# EasyEDA schematic project2_sound_system_incompletev1.1.json
TITLE: Sistema de Som para cliente Y; REV: 1.0; Date: 2023-12-21; Sheet: 1/1; Drawn By: Equipa X; Company: Equipa X
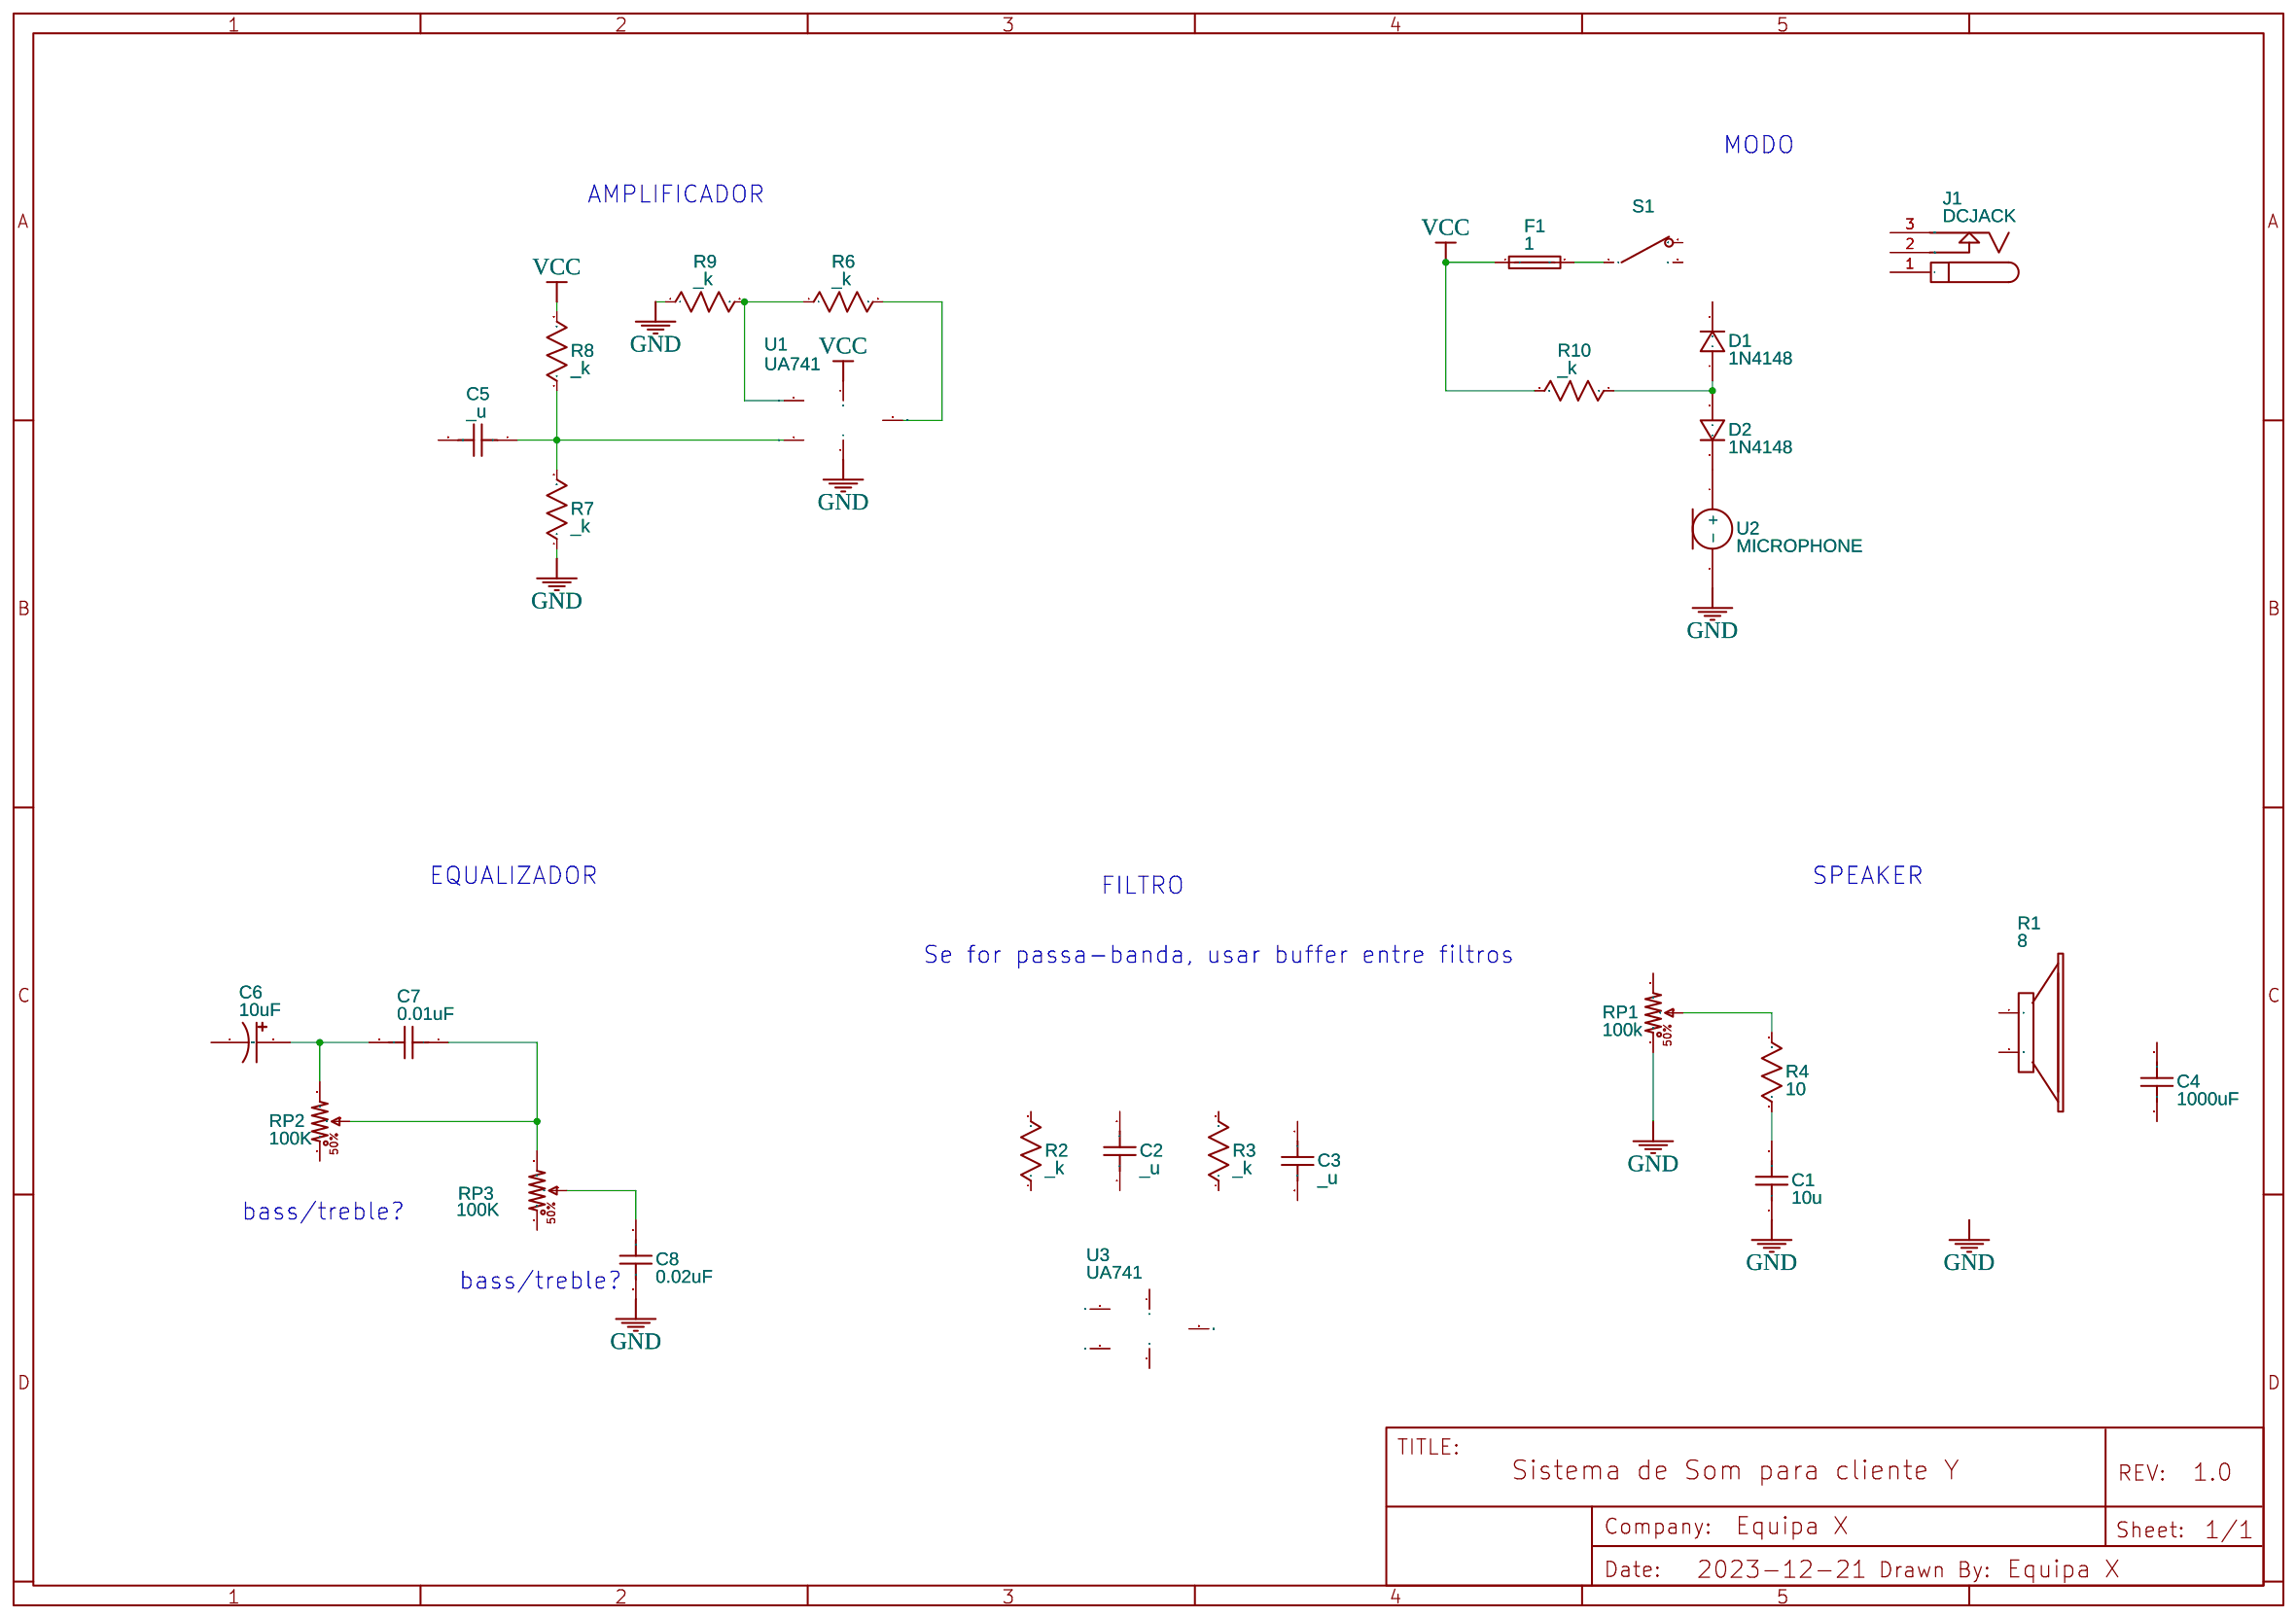
[diagram p0: schematic sheet]

## Parts
C1  10u  [RAD-0.1]
C2  _u  [RAD-0.1]
C3  _u  [RAD-0.1]
C4  1000uF  [RAD-0.1]
C5  _u  [RAD-0.1]
C6  10uF  [CAP-D3.0XF1.5]
C7  0.01uF  [RAD-0.1]
C8  0.02uF  [RAD-0.1]
D1  1N4148  [DO-35]
D2  1N4148  [DO-35]
F1  1
J1  DCJACK  [DC JACK]
R1  8  [1X02]
R2  _k  [AXIAL-0.3]
R3  _k  [AXIAL-0.3]
R4  10  [AXIAL-0.3]
R6  _k  [AXIAL-0.3]
R7  _k  [AXIAL-0.3]
R8  _k  [AXIAL-0.3]
R9  _k  [AXIAL-0.3]
R10  _k  [AXIAL-0.3]
RP1  100k  [RES-ADJ_3386P]
RP2  100K  [RES-ADJ_3386P]
RP3  100K  [RES-ADJ_3386P]
S1  SPDT_Open
U1  UA741
U2  MICROPHONE  [MICROPHONE]
U3  UA741

## Library data of the parts
C1-C5 C7 C8 = Capacitor_US: Contributor: EasyEDA; Supplier: YUJING; Capacitance: 1u
C6 = Capacitor_Electrolytic_US: Supplier: YUJING; Contributor: EasyEDA; Capacitance: 1u
D1 D2 = 1N4148: Contributor: EasyEDA
F1 = FUSE: Contributor: EasyEDA
J1 = DCJACK: Contributor: onuralpdogan89; sourceId: n0UO6oGYg; sim: true
R1 = Speaker: sourceId: LXRL3lewO
R2-R4 R6-R10 = Resistor_US: Resistance: 1k; Contributor: EasyEDA; Supplier: YUJING
RP1 = POTENTIOMETER: Resistance: 100K; K: 50
RP2 RP3 = POTENTIOMETER: K: 50
S1 = SPDT: catid: 20; Contributor: EasyEDA; State: Open; NameDisplay: 0
U1 U3 = UA741: Contributor: EasyEDA
U2 = MICROPHONE: Contributor: kurzaev.daniil

## Nets
GND: C1.1 C8.2 R7.1 R9.1 RP1.1 U1.4(V-) U2.2(-)
VCC: F1.1 R8.2 R10.2 U1.7(V+)
Net-(C1-2): C1.2 R4.1
Net-(C5-1): C5.1 R7.2 R8.1 U1.3(IN+)
Net-(C6-1): C6.1 C7.2 RP2.3
Net-(C7-1): C7.1 RP2.2 RP3.3
Net-(C8-1): C8.1 RP3.2
Net-(D1-1): D1.1(A) D2.1(A) R10.1
Net-(D2-2): D2.2(K) U2.1(+)
Net-(F1-2): F1.2 S1.1
Net-(R4-2): R4.2 RP1.2
Net-(R6-1): R6.1 R9.2 U1.2(IN-)
Net-(R6-2): R6.2 U1.6(OUT)

Not connected (* = marked no-connect by the designer): C2 1 2; C3 1 2; C4 1 2; C5 2; C6 2; D1 2(K); J1 1(+) 2(GND) 3(GND); R1 1 2; R2 1 2; R3 1 2; RP1 3; RP2 1; RP3 1; S1 2 3; U3 2(IN-) 3(IN+) 4(V-) 6(OUT) 7(V+)

## Notes on the sheet
- MODO
- AMPLIFICADOR
- EQUALIZADOR
- FILTRO
- SPEAKER
- Se for passa-banda, usar buffer entre filtros
- bass/treble?
- bass/treble?
